# EAGLE design Adafruit USB Type C Plug Breakout (EAGLE 9.6.2)
COMPANY: ADAFRUIT INDUSTRIES; DRAWN: KTOWN; REV: A; YEAR: 2019
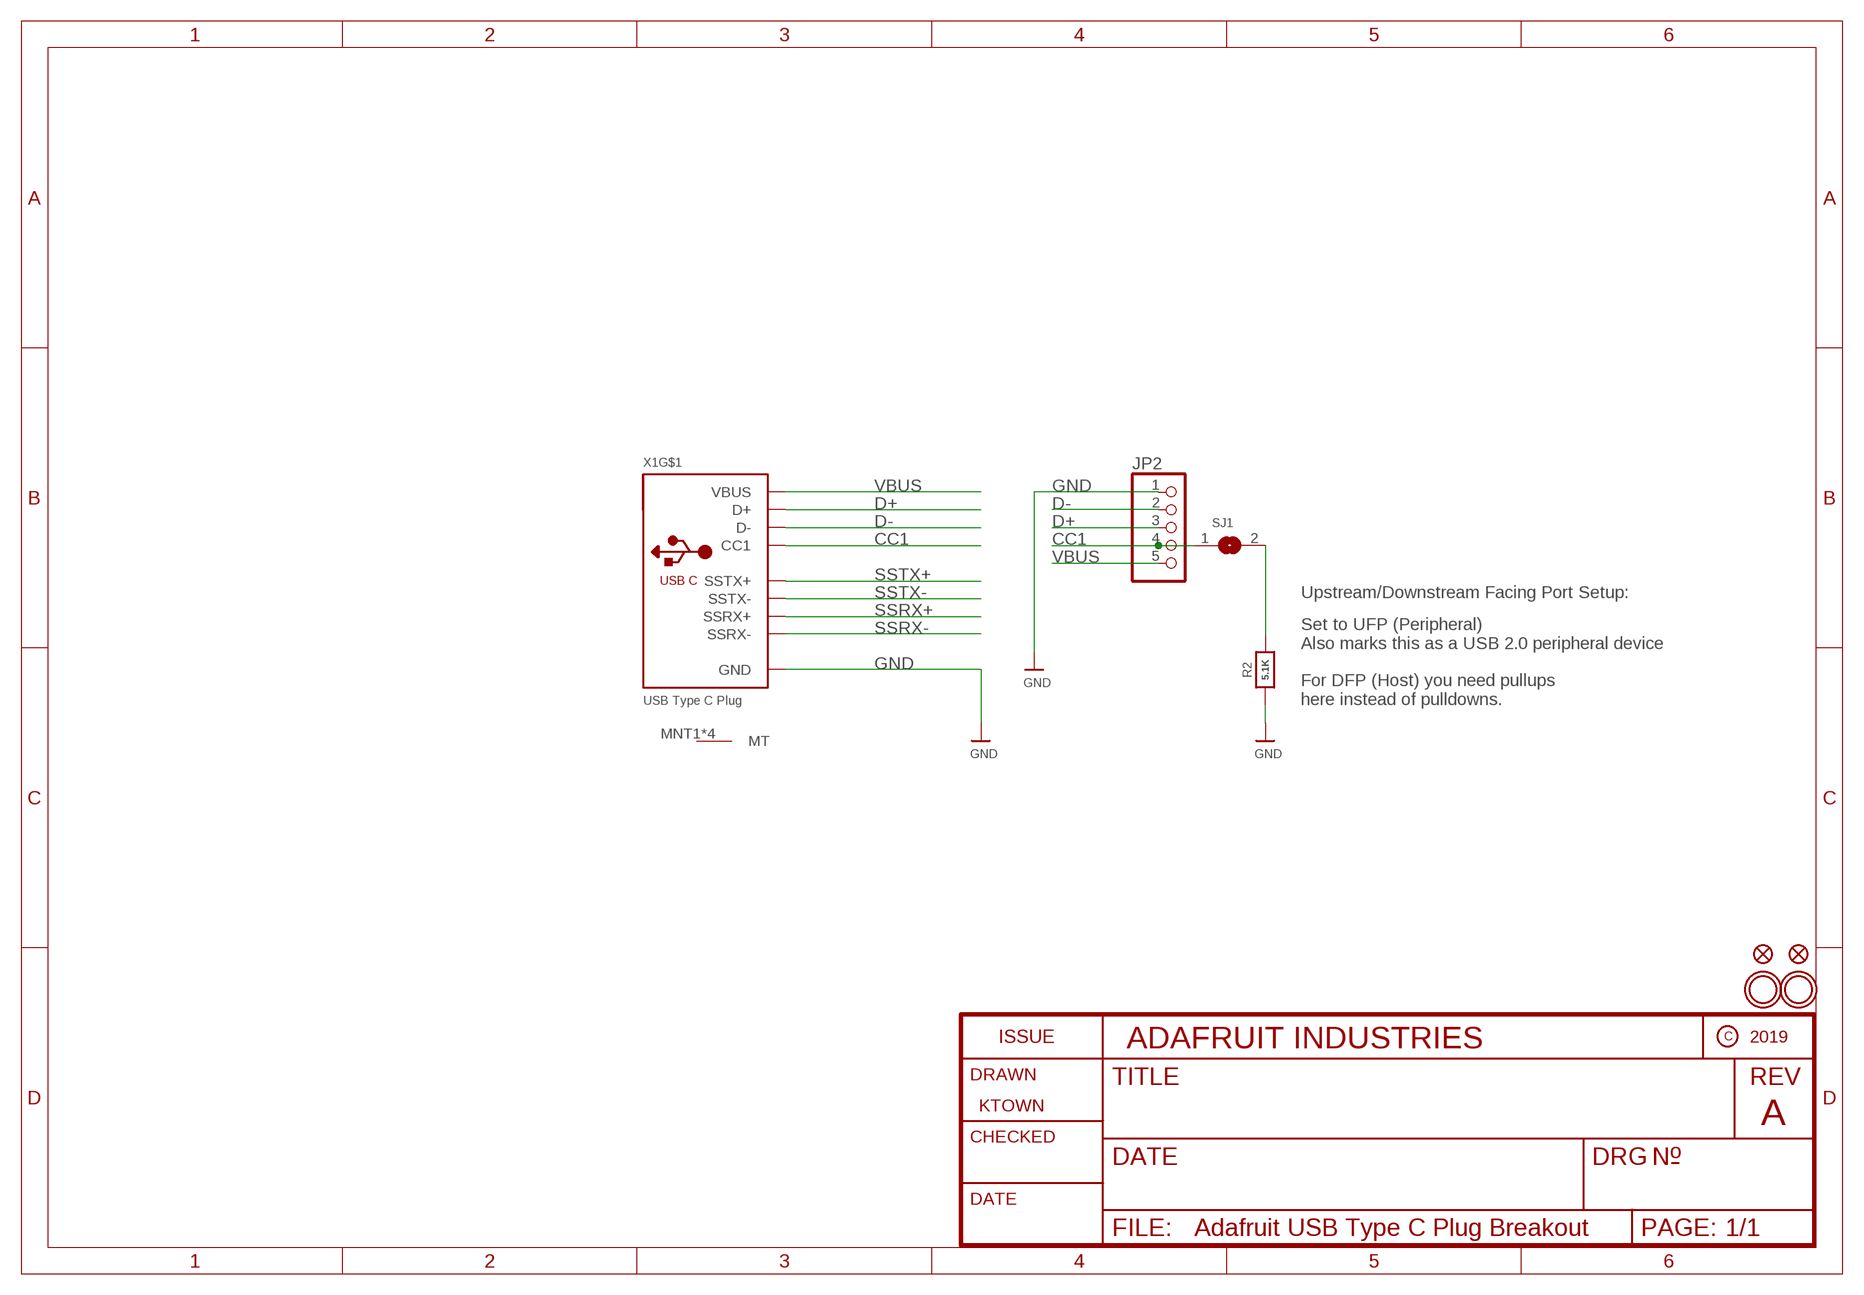
[diagram p0: schematic, sheet 1]

## Parts
FID1  FIDUCIAL_0.5MM  [FIDUCIAL_0.5MM]
FID2  FIDUCIAL_0.5MM  [FIDUCIAL_0.5MM]
JP2  HEADER-1X576MIL  [1X05_ROUND_76]
R2  5.1K  RESISTOR_0603_NOOUT  [0603-NO]
SJ1  SOLDERJUMPERCLOSED  [SOLDERJUMPER_CLOSEDWIRE]
U$1  MOUNTINGHOLE2.5  [MOUNTINGHOLE_2.5_PLATED]
U$2  MOUNTINGHOLE2.5  [MOUNTINGHOLE_2.5_PLATED]
X1  USB Type C Plug  USB_C_PLUG_12P  [USB_TYPEC_PLUG_12P]

## Nets
CC1: JP2.4 SJ1.1 X1.A5(CC1)
D+: JP2.3 X1.A6(D+)
D-: JP2.2 X1.A7(D-)
GND: JP2.1 R2.1 X1.A1(GND) X1.A12(GND) X1.B12(GND)
N$1: R2.2 SJ1.2
SSRX+: X1.B11(SSRX+)
SSRX-: X1.B10(SSRX-)
SSTX+: X1.A2(SSTX+)
SSTX-: X1.A3(SSTX-)
VBUS: JP2.5 X1.A4(VBUS) X1.B9(VBUS)
Unconnected: X1.MNT1(MT) X1.MNT2(MT) X1.P$1(MT) X1.P$2(MT)

## Notes on the sheet
- Upstream/Downstream Facing Port Setup:
- Set to UFP (Peripheral)
  Also marks this as a USB 2.0 peripheral device
  
  For DFP (Host) you need pullups
  here instead of pulldowns.

## Library data of the parts
FID1 FID2 = microbuilder:FIDUCIAL: Fiducial Alignment Points Various fiducial points for machine vision alignment.
JP2 = microbuilder:HEADER-1X5: PIN HEADER
R2 = microbuilder:RESISTOR: Resistors For new designs, use the packages preceded by an '_' character since they are more reliable: The following footprints should be used on most boards: _0402 - Standard footprint for regular board layouts _0603 - Standard footprint for regular board layouts _0805 - Standard footprint for regular board layouts _1206 - Standard footprint for regular board layouts For extremely tight-pitch boards where space is at a premium, the following 'micro-pitch' footprints can be used (smaller pads, no silkscreen outline, etc.): _0402MP - Micro-pitch footprint for very dense/compact boards _0603MP - Micro-pitch footprint for very dense/compact boards _0805MP - Micro-pitch footprint for very dense/compact boards _1206MP - Micro-pitch footprint for very dense/compact boards
SJ1 = microbuilder:SOLDERJUMPER: SMD Solder JUMPER Solder the two pads together to create a connection, or remove the solder to break it. REFLOW - Use this footprint for solder paste and reflow ovens. WAVE - Use this footprint for hand-soldering (larger pads). CLOSED - Has a trace between the two pads to ensure it is closed by default. The trace needs to be cut to disable the jumper, and can be closed again by creating a solder bridge between the two pads.
U$1 U$2 = adafruit_electromech:MOUNTINGHOLE: Mounting Hole For #2 screws (0.086"/2.18mm width, 0.094"/2.4mm hole) use 2.5mm; BOM: EXCLUDE
X1 = adafruit_electromech:USB_C_PLUG_12P: USB Type-C USB 2.0 Connector

## Board
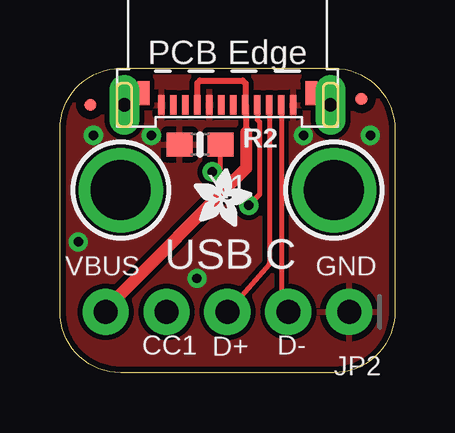
[diagram p1: board, top side]
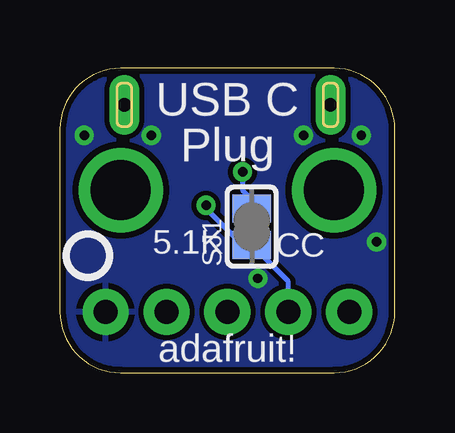
[diagram p2: board, bottom side, seen from below]

Size 13.97 x 12.7 mm. Coordinates in mm from the lower left corner, seen from the top.
Outline: 13.97,10.16 13.97,2.54 arc-90 11.43,0 2.54,0 arc-90 0,2.54 0,10.16 arc-90 2.54,12.7 11.43,12.7 arc-90 13.97,10.16
Copper layers (1*16): Top 0.035mm / dielectric 1.5mm / Bottom 0.035mm
Design rules "adafruit": minimum track width 8mil, minimum drill 15.5mil, track to track 8mil, track to pad 8mil, pad to pad 8mil, via to via 8mil, smd to smd 8mil, copper to edge 10mil, drill to drill 8mil, minimum pad ring 10mil, minimum via ring 8mil, stop-mask expansion 2mil, vias tented up to drill 20mil, thermal gap 10mil

### Footprints (pad centres in the part's own frame; a part is rotated, then mirrored left to right if it is on the bottom)
FIDUCIAL_0.5MM = smd 0.5 x 0.5: 1 0,0
1X05_ROUND_76 = drill 1 pad 1.93: 1 -5.08,0; 2 -2.54,0; 3 0,0; 4 2.54,0; 5 5.08,0
0603-NO = smd 1.075 x 1: 1 -0.85,0; 2 0.85,0
SOLDERJUMPER_CLOSEDWIRE = smd 1.168 x 1.6: 1 -0.762,0; 2 0.762,0 | smd 0.635 x 0.203: WIRE 0,0
MOUNTINGHOLE_2.5_PLATED = drill 2.5 pad 3.2: P$1 0,0
USB_TYPEC_PLUG_12P = smd 0.275 x 0.8: A1 2.75,0; A2 2.25,0; A3 1.75,0; A4 1.25,0; A5 -1.25,0; A6 -1.75,0; A7 -2.25,0; A12 -2.75,0; B9 -0.75,0; B10 -0.25,0; B11 0.25,0; B12 0.75,0 | drill 0.55 pad 1.25 long: MNT1 -4.3,0; MNT2 4.3,0 | smd 0.5 x 1: P$1 3.5,-0.5; P$2 -3.5,-0.5

### Placement (x,y rotation side)
FID1  12.57,11.43 180 top
FID2  1.27,11.18 180 top
JP2  6.99,2.54 180 top
R2  5.84,9.53 0 top
SJ1  5.97,6.1 90 bottom
U$1  11.43,7.62 180 top
U$2  2.54,7.62 180 top
U$3  [ADAFRUIT_2.5MM]  5.59,6.1 0 top
U$8  [PCBFEAT-REV-040]  12.8,4.88 180 bottom
X1  6.99,11.18 180 top

### Tracks (layer width: path | path; a pad name or v marks a point on that pad's centre or on a via)
CC1  (via drill 0.39)
  Top 0.203: X1.A5 8.23,10.56 8.33,10.47 8.33,7.44 v7.87,6.99
  Bottom 0.203: v7.87,6.99 7.87,6.86 6.35,5.33 SJ1.1 4.45,3.81 JP2.4
D+
  Top 0.203: X1.A6 8.73,4.54 JP2.3
D-
  Top 0.203: X1.A7 9.23,3.08 JP2.2
GND  (via drill 0.39)
  other vias: 10.16,9.91 12.95,9.91 3.81,9.91 1.4,9.91 5.71,3.94 0.76,5.46
  pour Top: 0,12.7 13.97,12.7 13.97,0 0,0
  pour Bottom: 0,12.7 13.97,12.7 13.97,0 0,0
N$1  (via drill 0.39)
  Top 0.203: R2.2 6.69,8.51 6.57,8.38 v6.35,8.38
  Bottom 0.203: SJ1.2 5.92,6.86 5.74,7.01 6.35,7.62 v6.35,8.38
VBUS
  Top 0.254: X1.A4 5.74,12.09 5.84,12.19 7.62,12.19 7.75,12.06 X1.B9 7.77,11.14 7.77,10.04
  Top 0.508: 7.77,10.04 7.77,8.53 2.03,2.79 JP2.5

### Text on the board
tPlace: VBUS | USB C | GND | D+ | CC1 | D-
bPlace: USB C | Plug | CC | 5.1K | adafruit!